# EAGLE design as5600_adapter (EAGLE 9.5.2)
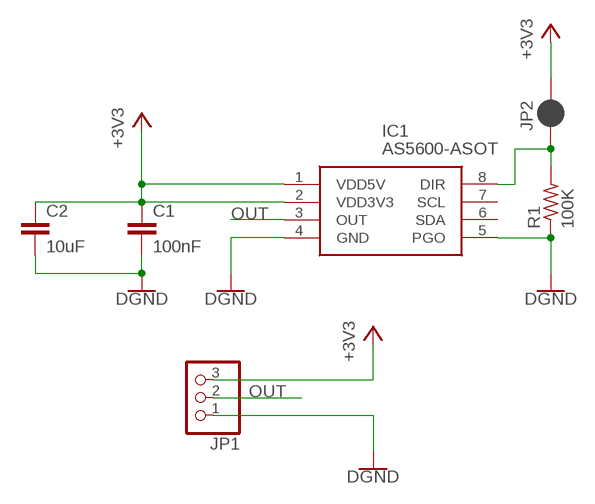
[diagram p0: schematic, sheet 1]

## Parts
C1  100nF  C-EUC0603  [C0603]
C2  10uF  C-EUC0805  [C0805]
IC1  AS5600-ASOT  [SOIC127P600X175-8N]
JP1  PINHD-1X3  [1X03]
JP2  JUMPER-SMT_2_NC_PASTE_NO-SILK  [SMT-JUMPER_2_NC_PASTE_NO-SILK]
R1  100K  R-US_R0603  [R0603]

## Nets
+3V3: C1.1 C2.1 IC1.1(VDD5V) IC1.2(VDD3V3) JP1.3 JP2.2
GND: C1.2 C2.2 IC1.4(GND) IC1.5(PGO) JP1.1 R1.1 ; supply symbol labelled DGND
N$1: IC1.8(DIR) JP2.1 R1.2
OUT: IC1.3(OUT) JP1.2
Unconnected: IC1.6(SDA) IC1.7(SCL)

## Library data of the parts
C1 C2 = rcl:C-EU: CAPACITOR, European symbol; SPICEPREFIX: C
IC1 = SPEAR:AS5600-ASOT: Board Mount Hall Effect / Magnetic Sensors AS5600 Magnetic Sensor 12-Bit Source: Datasheet <http://www.ams.com/eng/content/download/639463/1698857/325295>; DESCRIPTION: Board Mount Hall Effect / Magnetic Sensors AS5600 Magnetic Sensor 12-Bit; HEIGHT: 1.75mm; MANUFACTURER_NAME: ams; MANUFACTURER_PART_NUMBER: AS5600-ASOT; MOUSER_PART_NUMBER: 985-AS5600-ASOT; MOUSER_PRICE-STOCK: https://www.mouser.com/Search/Refine.aspx?Keyword=985-AS5600-ASOT
JP1 = pinhead:PINHD-1X3: PIN HEADER
JP2 = SparkFun-Jumpers:JUMPER-SMT_2_NC_PASTE: Normally closed solder jumper This jumper has an aperture in the stencil to allow solder paste to bridge the split in the wire so it's normally closed (NC). Wick off the solder to open the connection. Reapply solder to reclose the connection.
R1 = rcl:R-US_: RESISTOR, American symbol; SPICEPREFIX: R

## Board
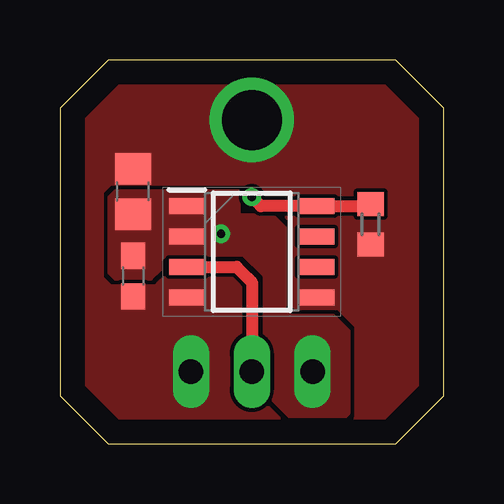
[diagram p1: board, top side]
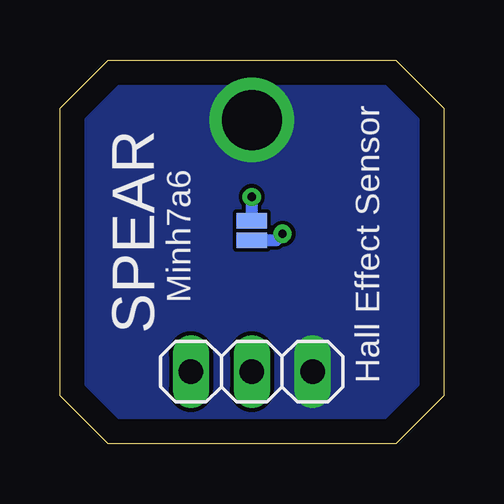
[diagram p2: board, bottom side, seen from below]

Size 16 x 16 mm. Coordinates in mm from the lower left corner, seen from the top.
Outline: 0,14 0,2 2,0 14,0 16,2 16,14 14,16 2,16 0,14
Copper layers (1*16): Top 0.035mm / dielectric 1.5mm / Bottom 0.035mm
Design rules "default *": minimum track width 6mil, minimum drill 0.35mm, track to track 6mil, track to pad 6mil, pad to pad 6mil, via to via 6mil, smd to smd 6mil, copper to edge 40mil, drill to drill 6mil, minimum pad ring 10mil, minimum via ring 8mil, stop-mask expansion 4mil, vias tented up to drill 20mil, thermal gap 10mil

### Footprints (pad centres in the part's own frame; a part is rotated, then mirrored left to right if it is on the bottom)
C0603 = smd 1.1 x 1: 1 -0.85,0; 2 0.85,0
C0805 = smd 1.3 x 1.5: 1 -0.95,0; 2 0.95,0
SOIC127P600X175-8N = smd 1.5 x 0.65: 1 -2.7,1.905; 2 -2.7,0.635; 3 -2.7,-0.635; 4 -2.7,-1.905; 5 2.7,-1.905; 6 2.7,-0.635; 7 2.7,0.635; 8 2.7,1.905
1X03 = drill 1.016 long: 1 -2.54,0; 2 0,0; 3 2.54,0
SMT-JUMPER_2_NC_PASTE_NO-SILK = smd 0.635 x 1.27: 1 -0.406,0; 2 0.406,0
R0603 = smd 1 x 1.1: 1 -0.85,0; 2 0.85,0

### Placement (x,y rotation side)
C1  3.05,6.99 270 top
C2  3.05,10.51 90 top
IC1  8,8 0 top
JP1  8,3 180 bottom
JP2  8,8.89 270 bottom
R1  12.95,9.14 90 top

### Tracks (layer width: path | path; a pad name or v marks a point on that pad's centre or on a via)
+3V3  (via drill 0.35)
  Bottom 0.508: JP2.2 6.98,8.48 v6.72,8.75
  pour Top (no thermals): 9.53,1.14 11.94,1.14 12.06,1.27 12.06,4.7 11.43,5.33 9.65,5.33 9.4,5.59 9.4,9.02 8.89,9.53 7.49,9.53 7.49,10.54 2.29,10.54 2.03,10.29 2.03,7.11 2.29,6.86 3.81,6.86 4.19,7.24 4.19,7.62 4.45,7.87 7.62,7.87 8.51,6.99 8.51,4.57 8.76,4.32 8.76,1.91
GND  (via drill 2.5)
  other vias: 8,13.5
  pour Top (rank 6, no thermals): -1.4,17.27 -1.4,-0.13 -0.51,-1.02 16.76,-1.02 17.4,-0.38 17.53,-0.25 17.53,16.64 16.89,17.27
  pour Bottom (rank 6, no thermals): -0.51,16.76 -0.51,-0.38 0,-0.89 15.75,-0.89 16.76,0.13 16.76,16.13 16,16.89 -0.38,16.89
N$1  (via drill 0.35)
  Top 0.508: R1.2 12.87,9.9 IC1.8 8.38,9.9 v8,10.29
  Bottom 0.508: v8,10.29 JP2.1
OUT
  Top 0.508: IC1.3 7.37,7.37 7.87,6.87 8,6.73 JP1.2

### Text on the board
bPlace: Hall Effect Sensor | SPEAR | Minh7a6